# Altium schematic sheet 1_电源.schdoc.schdoc
size 309 x 223 mm; Symbol: Sheet-Symbol_A4; Device: Sheet-Symbol_A4; Company: 嘉立创EDA; Drawed: 吴登珂; Version: V1.0; Page Size: A4; @Project Name: 最小系统板; @Page Count: 4; @Update Date: 2024-04-13; @Create Date: 2024-04-05; @Schematic Name: Schematic1; @Page No: 1; @Page Name: 电源
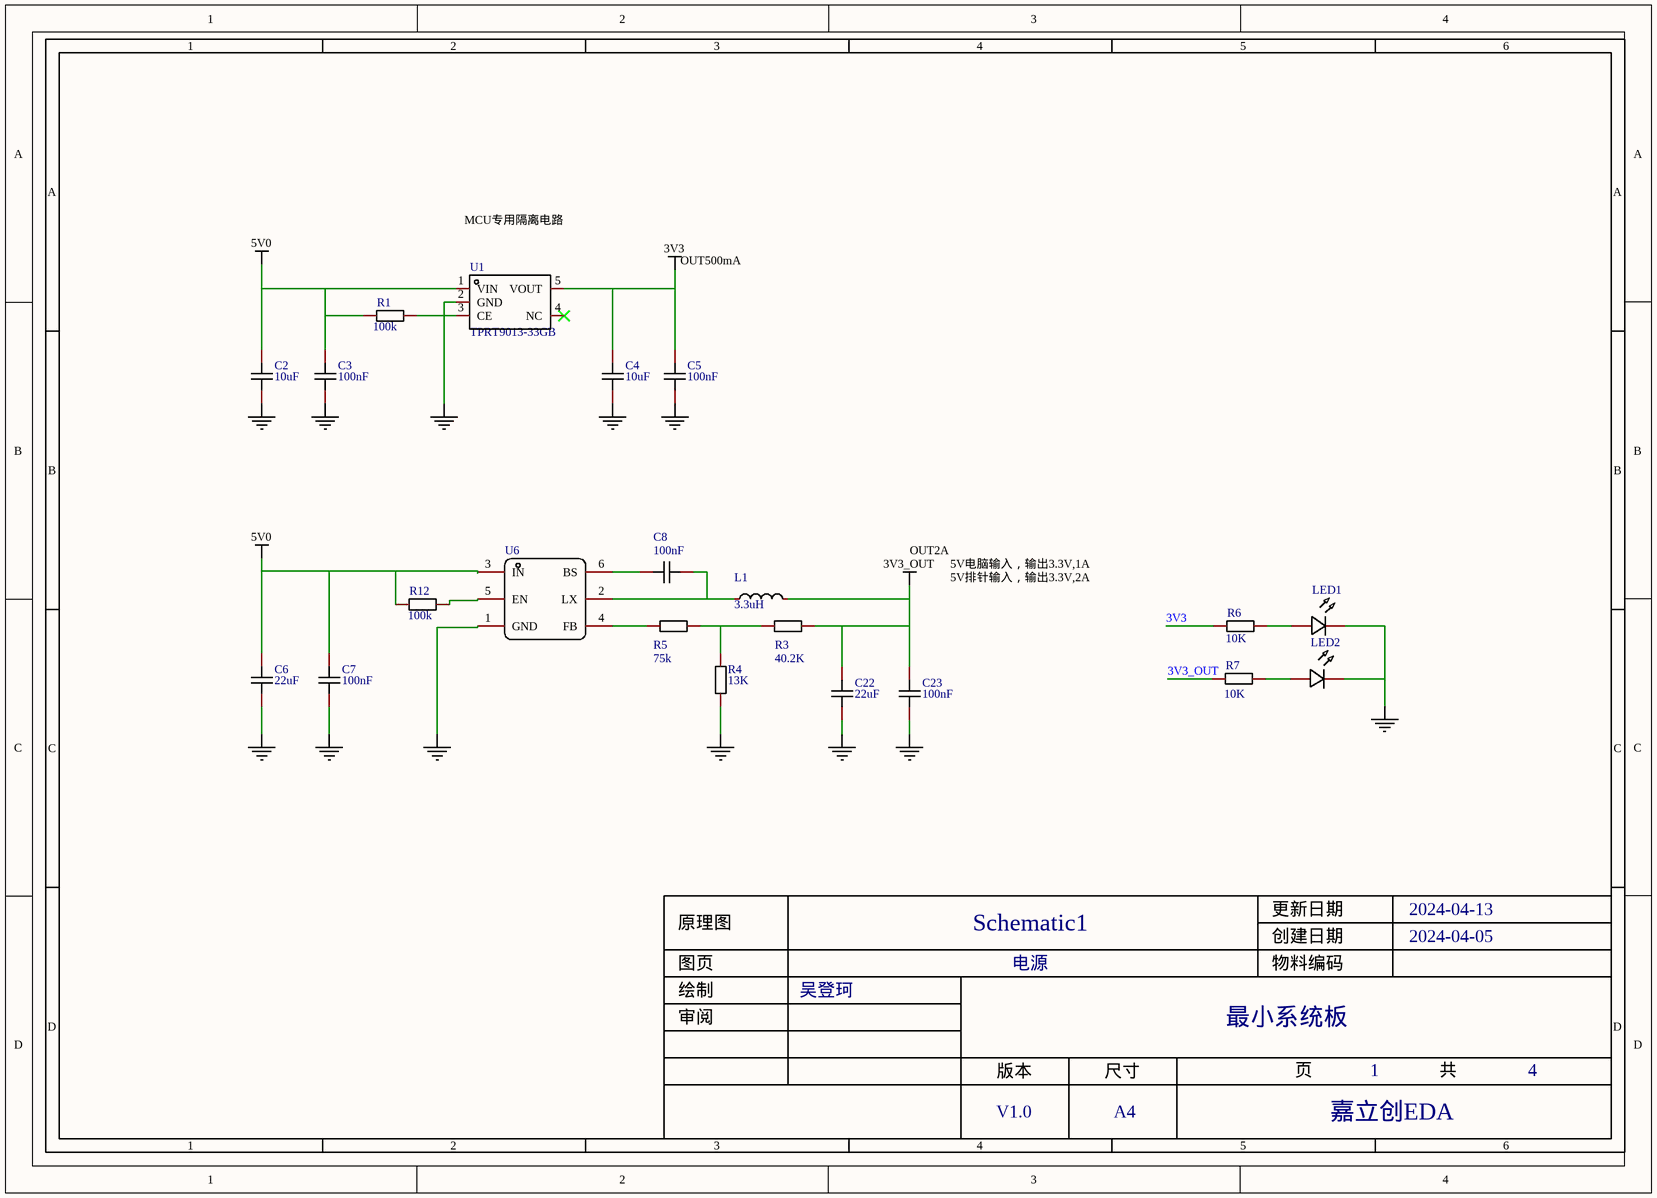
[diagram p0: 1_电源.schdoc.schdoc]

## Parts
C2  10uF  [C0603]
C3  100nF  [C0603]
C4  10uF  [C0603]
C5  100nF  [C0603]
C6  22uF  [C1206]
C7  100nF  [C0603]
C8  100nF  [C0603]
C22  22uF  [C1206]
C23  100nF  [C0603]
L1  3.3uH  [IND-SMD_L7.3-W6.6]
LED1  LED_0603-R  [LED_0603]  (value not drawn)
LED2  LED_0603-R  [LED_0603]  (value not drawn)
R1  100k  [R0603]
R3  40.2K  [R0603]
R4  13K  [R0603]
R5  75k  [R0603]
R6  10K  [R0603]
R7  10K  [R0603]
R12  100k  [R0603]
U1  TPRT9013-33GB  [SOT-23-5_L3.0-W1.7-P0.95-LS2.8-BL]
U6  TPMP1470GJ-Z  [SOT-23-6_L2.9-W1.6-P0.95-LS2.8-BL]  (value not drawn)

## Nets
3V3: C4.2 C5.2 R6.1 U1.5(VOUT)
3V3_OUT: C22.2 C23.2 L1.2 R3.1 R7.1
5V0: C2.2 C3.2 C6.2 C7.2 R1.1 R12.1 U1.1(VIN) U6.3(IN)
NetC2_1: C2.1 C3.1 C4.1 C5.1 C6.1 C7.1 C22.1 C23.1 LED1.1(C) LED2.1(C) R4.1 U1.2(GND) U6.1(GND)
NetC8_1: C8.1 U6.6(BS)
NetC8_2: C8.2 L1.1 U6.2(LX)
NetLED1_2: LED1.2(A) R6.2
NetLED2_2: LED2.2(A) R7.2
NetR1_2: R1.2 U1.3(CE)
NetR3_2: R3.2 R4.2 R5.2
NetR5_1: R5.1 U6.4(FB)
NetR12_2: R12.2 U6.5(EN)

Not connected (* = marked no-connect by the designer): U1 4(NC)*

## Notes on the sheet
- MCU专用隔离电路
- OUT500mA
- OUT2A
- 5V电脑输入，输出3.3V,1A
- 5V排针输入，输出3.3V,2A
- 1
- 2
- 3
- 4
- 5
- 6
- A
- B
- C
- 原理图
- Schematic1
- 创建日期
- 更新日期
- 2024-04-13
- 2024-04-05
- 审阅
- 绘制
- 图页
- 吴登珂
- 电源
- 物料编码
- 最小系统板
- D
- 版本
- 尺寸
- 页
- 共
- V1.0
- A4
- 嘉立创EDA

## Library data of the parts
C2-C5 C7 C8 C23 = CAP_0603: Symbol: CapAcitance; Convert to PCB: yes; Device: CAP_0603; Add into BOM: yes; Supplier Footprint: 0603
  C2 C4: Name: 10uF; Value: 10uF
  C3 C5 C7 C8 C23: Name: 100nF; Value: 100nF
C6 C22 = CAP_1206: Symbol: CapAcitance; Convert to PCB: yes; Name: 22uF; Device: CAP_1206; Add into BOM: yes; Supplier Footprint: 1206; Value: 22uF
L1 = MCS0630-2R2MPY1: Manufacturer: PSA(信昌电陶); Add into BOM: yes; Tolerance: ±20%; Rated Current: 8A; Saturation Current (Isat): 12A; DC Resistance (DCR): 17mΩ; Description: 电感值:2.2uH;精度:±20%;额定电流:8A;饱和电流(Isat):12A;; Name: 3.3uH; Symbol: MCS0630-2R2MPY1; Device: MCS0630-2R2MPY1; LCSC Part Name: 2.2uH ±20% 12A; Supplier Part: C2937096; Manufacturer Part: MCS0630-2R2MPY1; Supplier Footprint: 0630; JLCPCB Part Class: 扩展库; Datasheet: https://atta.szlcsc.com/upload/public/pdf/source/20220121/EA6E6E6F70ED7BAE67EC293805EAAACB.pdf; Supplier: LCSC; Convert to PCB: yes; Value: 3.3uH
LED1 LED2 = LED_0603-R: Symbol: LED_R; Convert to PCB: yes; Device: LED_0603-R; Add into BOM: yes; Supplier Footprint: 0603
R1 R3-R7 R12 = Res_0603: Symbol: 电阻; Convert to PCB: yes; Device: Res_0603; Add into BOM: yes; Supplier Footprint: 0603
  R1 R12: Name: 100k; Value: 100k
  R3: Name: 40.2K; Value: 40.2K
  R4: Name: 13K; Value: 13K
  R5: Name: 75k; Value: 75k
  R6 R7: Name: 10K; Value: 10K
U1 = TPRT9013-33GB: Manufacturer: TECH PUBLIC(台舟); Add into BOM: yes; Description: 输出类型:-;; Name: TPRT9013-33GB; Symbol: TPRT9013-33GB; Device: TPRT9013-33GB; LCSC Part Name: TPRT9013-33GB; Supplier Part: C587158; Manufacturer Part: TPRT9013-33GB; Supplier Footprint: SOT-23-5; JLCPCB Part Class: 扩展库; Datasheet: https://atta.szlcsc.com/upload/public/pdf/source/20210810/692D4D0C3CF190F9330EFD28C3E572CB.pdf; Supplier: LCSC; Convert to PCB: yes; Output Type: -
U6 = TPMP1470GJ-Z: Manufacturer: TECH PUBLIC(台舟); Add into BOM: yes; Name: TPMP1470GJ-Z; Symbol: TPMP1470GJ-Z; Device: TPMP1470GJ-Z; LCSC Part Name: TPMP1470GJ-Z; Supplier Part: C558426; Manufacturer Part: TPMP1470GJ-Z; Supplier Footprint: SOT-23-6; JLCPCB Part Class: 扩展库; Datasheet: https://atta.szlcsc.com/upload/public/pdf/source/20210810/DC77DEB6764AF65BB1526AC3D213695F.pdf; Supplier: LCSC; Convert to PCB: yes